# EAGLE schematic ads_pcb_v1 (EAGLE 7.7.0)
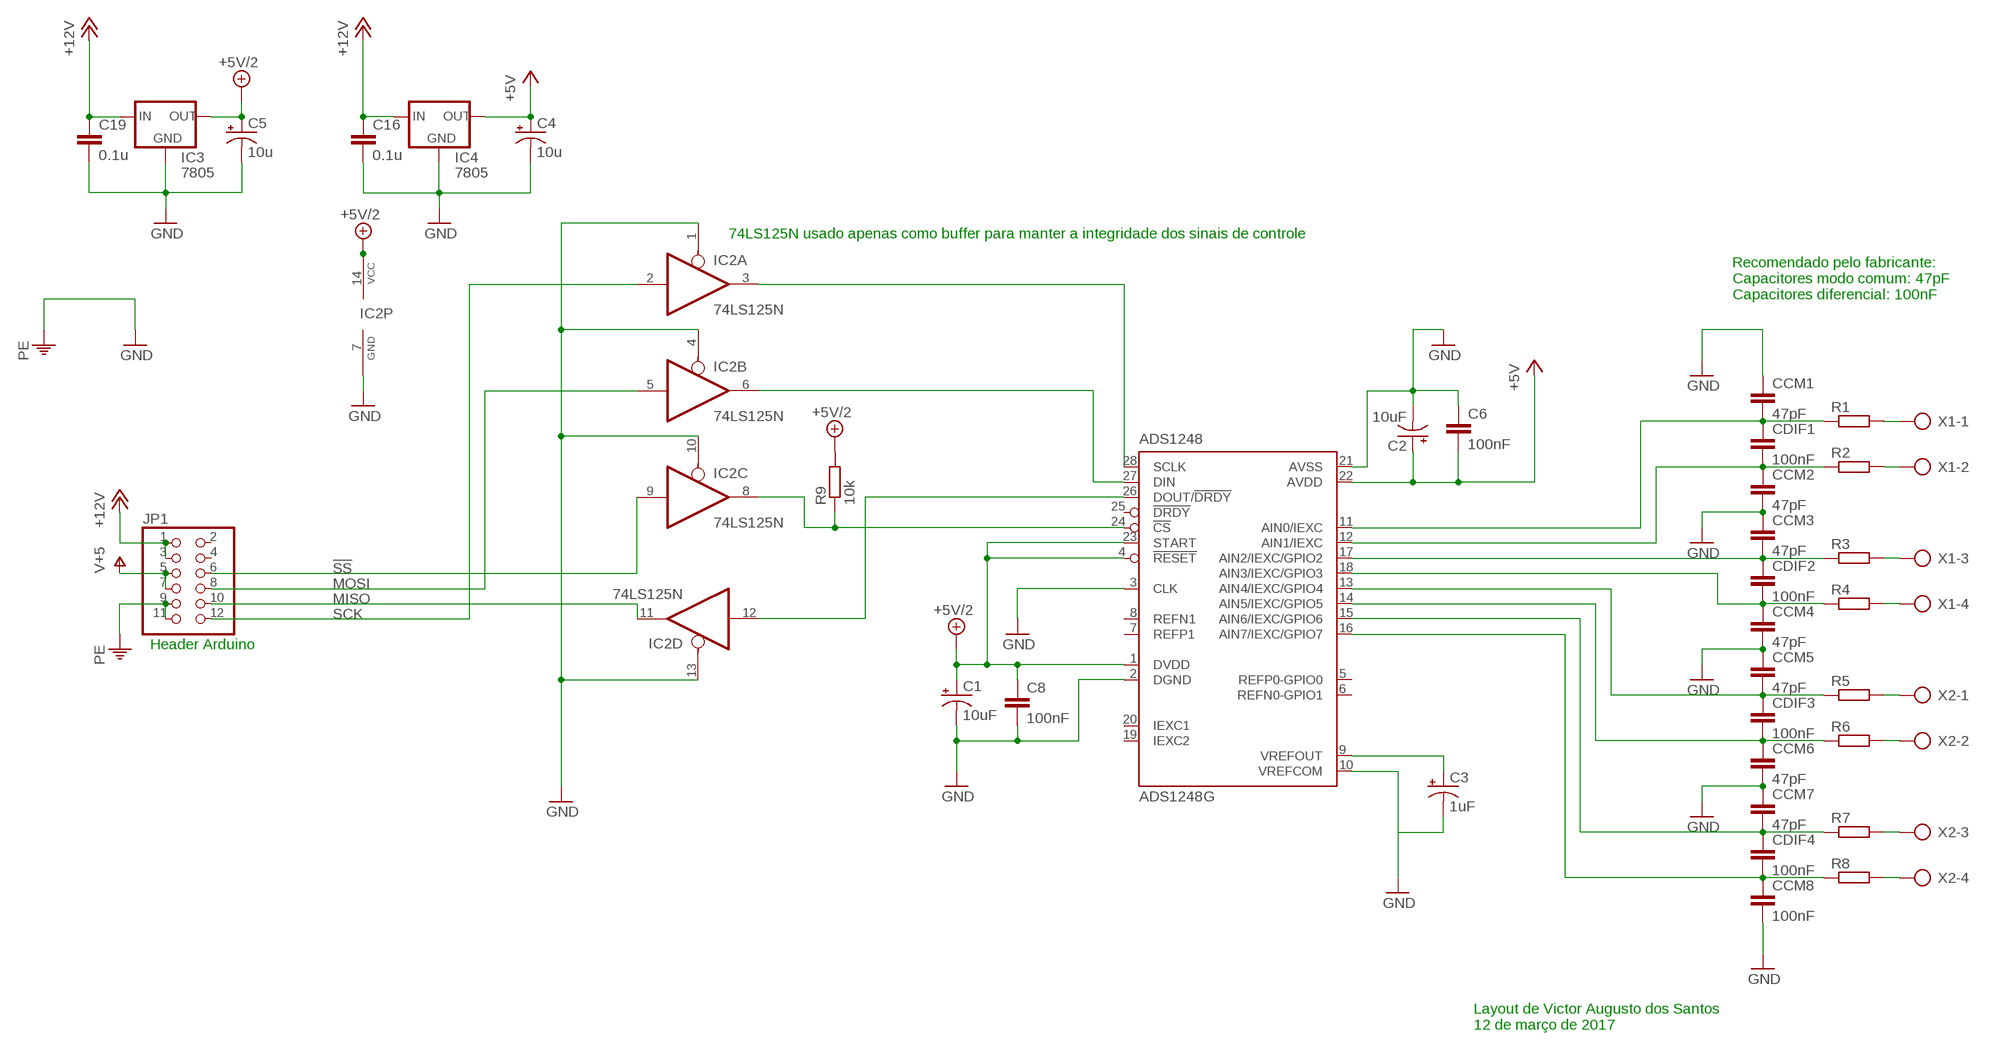
[diagram p0: schematic, sheet 1]

## Parts
C1  10uF  CPOL-USE2-5  [E2-5]
C2  10uF  CPOL-USE2-5  [E2-5]
C3  1uF  CPOL-USE2-5  [E2-5]
C4  10u  CPOL-USE2-5  [E2-5]
C5  10u  CPOL-USE2-5  [E2-5]
C6  100nF  C5/3  [C5B3]
C8  100nF  C5/3  [C5B3]
C16  0.1u  C5/3  [C5B3]
C19  0.1u  C5/3  [C5B3]
CCM1  47pF  C5/2.5  [C5B2.5]
CCM2  47pF  C5/2.5  [C5B2.5]
CCM3  47pF  C5/2.5  [C5B2.5]
CCM4  47pF  C5/2.5  [C5B2.5]
CCM5  47pF  C5/2.5  [C5B2.5]
CCM6  47pF  C5/3  [C5B3]
CCM7  47pF  C5/2.5  [C5B2.5]
CCM8  100nF  C5/2.5  [C5B2.5]
CDIF1  100nF  C5/2.5  [C5B2.5]
CDIF2  100nF  C5/2.5  [C5B2.5]
CDIF3  100nF  C5/2.5  [C5B2.5]
CDIF4  100nF  C5/2.5  [C5B2.5]
IC1  ADS1248G  [P-TSSOP28-1]
IC2  74LS125N  [DIL14]
IC3  7805  78XXL  [78XXL]
IC4  7805  78XXL  [78XXL]
JP1  PINHD-2X6  [2X06]
R1  R-EU_0204/7  [0204/7]
R2  R-EU_0204/7  [0204/7]
R3  R-EU_0204/7  [0204/7]
R4  R-EU_0204/7  [0204/7]
R5  R-EU_0204/7  [0204/7]
R6  R-EU_0204/7  [0204/7]
R7  R-EU_0204/7  [0204/7]
R8  R-EU_0204/7  [0204/7]
R9  10k  R-EU_0204/7  [0204/7]
X1  AK500/4-H  [AK500/4-H]
X2  AK500/4-H  [AK500/4-H]

## Nets
!SS: IC2.9(C:I) JP1.6
+5V: C2.+ C4.+ C6.2 IC1.22(AVDD) IC4.OUT
+5V/2: C1.+ C5.+ C8.1 IC1.1(DVDD) IC1.4(!RESET) IC1.23(START) IC2.14(P:VCC) IC3.OUT R9.2
+12V: C16.1 C19.1 IC3.IN IC4.IN JP1.1 JP1.3
GND: C1.- C2.- C3.- C4.- C5.- C6.1 C8.2 C16.2 C19.2 CCM1.1 CCM2.2 CCM3.1 CCM4.2 CCM5.1 CCM6.2 CCM7.1 CCM8.2 IC1.2(DGND) IC1.3(CLK) IC1.10(VREFCOM) IC1.21(AVSS) IC2.1(A:OE) IC2.4(B:OE) IC2.7(P:GND) IC2.10(C:OE) IC2.13(D:OE) IC3.GND IC4.GND ; supply symbol labelled PE
MISO: IC2.11(D:O) JP1.10
MOSI: IC2.5(B:I) JP1.8
N$1: C3.+ IC1.9(VREFOUT)
N$2: CCM1.2 CDIF1.1 IC1.11(AIN0/IEXC) R1.1
N$3: CCM2.1 CDIF1.2 IC1.12(AIN1/IEXC) R2.1
N$4: R2.2 X1.2
N$5: IC1.28(SCLK) IC2.3(A:O)
N$6: R8.2 X2.4
N$7: CCM5.2 CDIF3.1 IC1.13(AIN4/IEXC/GPIO4) R5.1
N$8: CCM7.2 CDIF4.1 IC1.15(AIN6/IEXC/GPIO6) R7.1
N$9: CCM6.1 CDIF3.2 IC1.14(AIN5/IEXC/GPIO5) R6.1
N$10: CCM4.1 CDIF2.2 IC1.18(AIN3/IEXC/GPIO3) R4.1
N$11: IC1.27(DIN) IC2.6(B:O)
N$12: IC1.26(DOUT/!DRDY) IC2.12(D:I)
N$13: IC1.24(!CS) IC2.8(C:O) R9.1
N$15: R1.2 X1.1
N$16: R7.2 X2.3
N$17: R6.2 X2.2
N$18: R5.2 X2.1
N$19: R4.2 X1.4
N$20: R3.2 X1.3
N$23: CCM8.1 CDIF4.2 IC1.16(AIN7/IEXC/GPIO7) R8.1
N$24: CCM3.2 CDIF2.1 IC1.17(AIN2/IEXC/GPIO2) R3.1
PE: JP1.9 JP1.11
SCK: IC2.2(A:I) JP1.12
V+: JP1.5 JP1.7 ; supply symbol labelled V+5
Unconnected: IC1.5(REFP0-GPIO0) IC1.6(REFN0-GPIO1) IC1.7(REFP1) IC1.8(REFN1) IC1.19(IEXC2) IC1.20(IEXC1) IC1.25(!DRDY) JP1.2 JP1.4

## Notes on the sheet
- 74LS125N usado apenas como buffer para manter a integridade dos sinais de controle
- Recomendado pelo fabricante:
  Capacitores modo comum: 47pF
  Capacitores diferencial: 100nF
- Header Arduino
- Layout de Victor Augusto dos Santos
  12 de março de 2017

## Library data of the parts
C1-C5 = resistor:CPOL-US: POLARIZED CAPACITOR, American symbol
C6 C8 C16 C19 CCM1-CCM8 CDIF1-CDIF4 = capacitor-wima:C: CAPACITOR naming: grid - package width
IC1 = mylib:ADS1248: Phase locked loop (PLL), with a multistandard video modulator and a programmable sound FM and AM modulator
IC2 = 74xx-us:74*125: Quad bus BUFFER, 3-state
IC3 IC4 = v-reg:78XXL: VOLTAGE REGULATOR
JP1 = pinhead:PINHD-2X6: PIN HEADER
R1-R9 = resistor:R-EU_: RESISTOR, European symbol
X1 X2 = con-ptr500:AK500/4-H: CONNECTOR Aug. 2004 / PTR Meßtechnik: Die Bezeichnung der Serie AK505 wurde geändert. Es handelt sich hierbei um AK500 in horizontaler Ausführung.